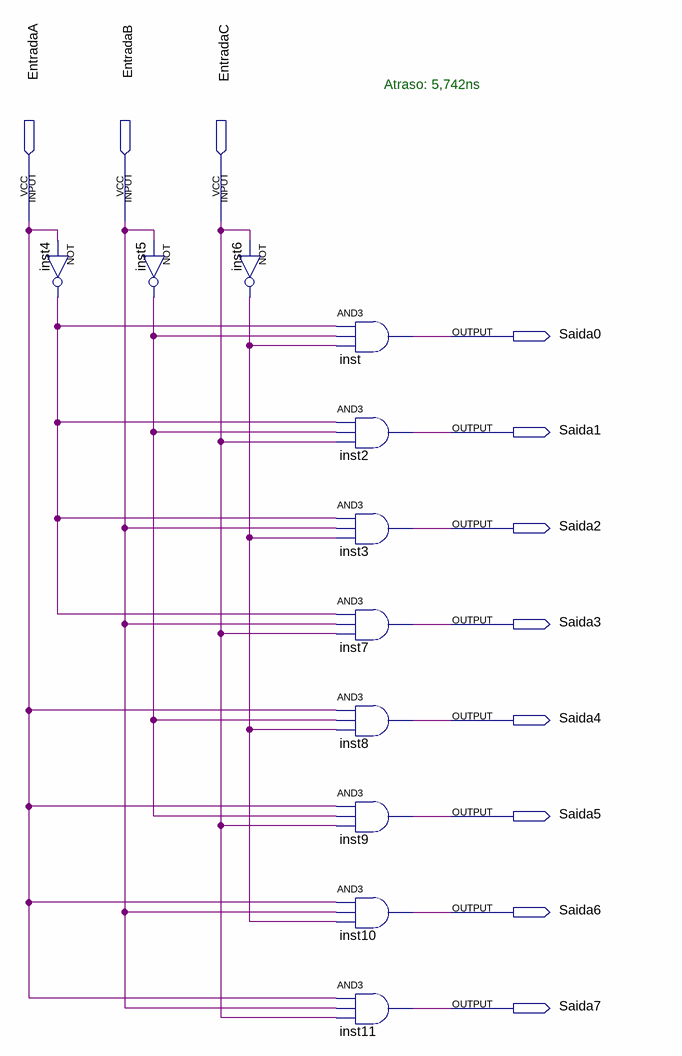
[diagram p0: schematic sheet]
// Quartus schematic Decoder3to8.bdf as structural Verilog: 11 symbols, 11 pins
module Decoder3to8 (
  input  EntradaA,
  input  EntradaB,
  input  EntradaC,
  output Saida0,
  output Saida1,
  output Saida2,
  output Saida3,
  output Saida4,
  output Saida5,
  output Saida6,
  output Saida7
);

  wire inst4_out, inst5_out, inst6_out;

  not inst4 (inst4_out, EntradaA);
  not inst5 (inst5_out, EntradaB);
  not inst6 (inst6_out, EntradaC);
  and inst (Saida0, inst4_out, inst5_out, inst6_out);
  and inst2 (Saida1, inst4_out, inst5_out, EntradaC);
  and inst3 (Saida2, inst4_out, EntradaB, inst6_out);
  and inst7 (Saida3, inst4_out, EntradaB, EntradaC);
  and inst8 (Saida4, EntradaA, inst5_out, inst6_out);
  and inst9 (Saida5, EntradaA, inst5_out, EntradaC);
  and inst10 (Saida6, EntradaA, EntradaB, inst6_out);
  and inst11 (Saida7, EntradaA, EntradaB, EntradaC);

  // Notes on the sheet:
  //   Atraso: 5,742ns
endmodule
